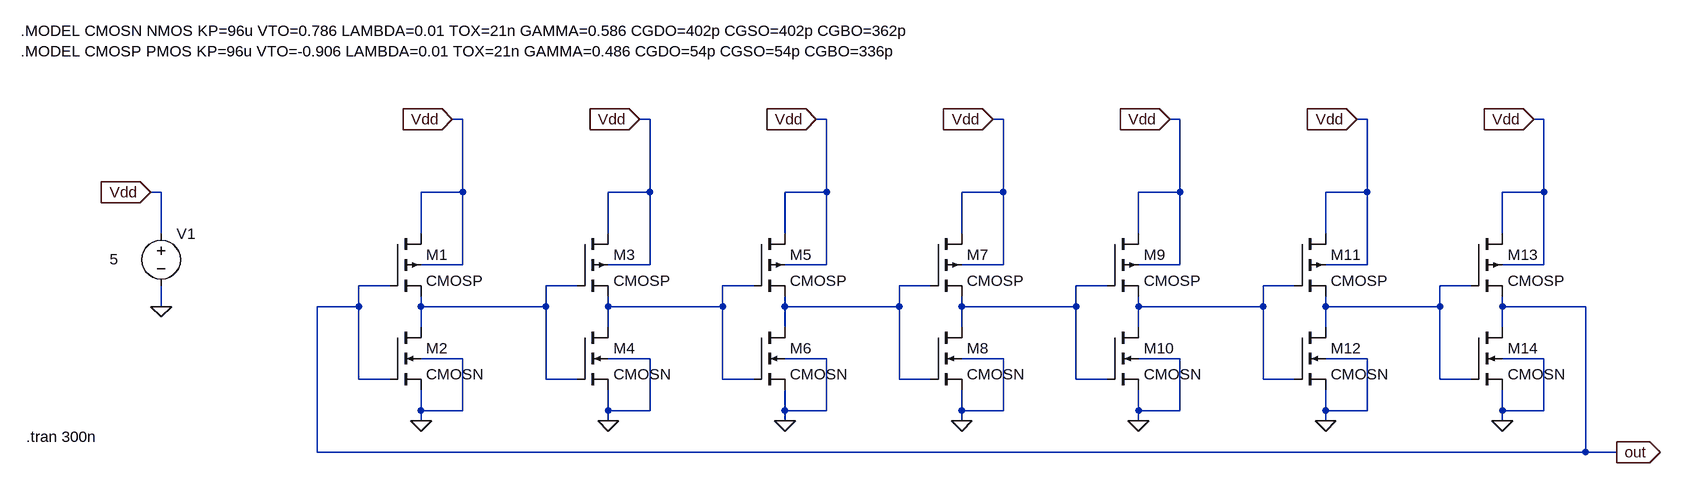
[diagram p0: schematic ring_oscillator.asc]
ring_oscillator.asc, the LTspice schematic file:
Version 4
SHEET 1 2556 680
WIRE 272 -128 256 -128
WIRE 560 -128 544 -128
WIRE 832 -128 816 -128
WIRE 1104 -128 1088 -128
WIRE 1376 -128 1360 -128
WIRE 1664 -128 1648 -128
WIRE 1936 -128 1920 -128
WIRE -192 -16 -208 -16
WIRE 272 -16 272 -128
WIRE 272 -16 208 -16
WIRE 560 -16 560 -128
WIRE 560 -16 496 -16
WIRE 832 -16 832 -128
WIRE 832 -16 768 -16
WIRE 1104 -16 1104 -128
WIRE 1104 -16 1040 -16
WIRE 1376 -16 1376 -128
WIRE 1376 -16 1312 -16
WIRE 1664 -16 1664 -128
WIRE 1664 -16 1600 -16
WIRE 1936 -16 1936 -128
WIRE 1936 -16 1872 -16
WIRE -192 48 -192 -16
WIRE 208 48 208 -16
WIRE 496 48 496 -16
WIRE 768 48 768 -16
WIRE 1040 48 1040 -16
WIRE 1312 48 1312 -16
WIRE 1600 48 1600 -16
WIRE 1872 48 1872 -16
WIRE 272 96 272 -16
WIRE 272 96 208 96
WIRE 560 96 560 -16
WIRE 560 96 496 96
WIRE 832 96 832 -16
WIRE 832 96 768 96
WIRE 1104 96 1104 -16
WIRE 1104 96 1040 96
WIRE 1376 96 1376 -16
WIRE 1376 96 1312 96
WIRE 1664 96 1664 -16
WIRE 1664 96 1600 96
WIRE 1936 96 1936 -16
WIRE 1936 96 1872 96
WIRE 160 128 112 128
WIRE 448 128 400 128
WIRE 720 128 672 128
WIRE 992 128 944 128
WIRE 1264 128 1216 128
WIRE 1552 128 1504 128
WIRE 1824 128 1776 128
WIRE -192 160 -192 128
WIRE 112 160 112 128
WIRE 112 160 48 160
WIRE 208 160 208 144
WIRE 400 160 400 128
WIRE 400 160 208 160
WIRE 496 160 496 144
WIRE 672 160 672 128
WIRE 672 160 496 160
WIRE 768 160 768 144
WIRE 944 160 944 128
WIRE 944 160 768 160
WIRE 1040 160 1040 144
WIRE 1216 160 1216 128
WIRE 1216 160 1040 160
WIRE 1312 160 1312 144
WIRE 1504 160 1504 128
WIRE 1504 160 1312 160
WIRE 1600 160 1600 144
WIRE 1776 160 1776 128
WIRE 1776 160 1600 160
WIRE 1872 160 1872 144
WIRE 2000 160 1872 160
WIRE 208 192 208 160
WIRE 496 192 496 160
WIRE 768 192 768 160
WIRE 1040 192 1040 160
WIRE 1312 192 1312 160
WIRE 1600 192 1600 160
WIRE 1872 192 1872 160
WIRE 272 240 208 240
WIRE 560 240 496 240
WIRE 832 240 768 240
WIRE 1104 240 1040 240
WIRE 1376 240 1312 240
WIRE 1664 240 1600 240
WIRE 1936 240 1872 240
WIRE 112 272 112 160
WIRE 160 272 112 272
WIRE 400 272 400 160
WIRE 448 272 400 272
WIRE 672 272 672 160
WIRE 720 272 672 272
WIRE 944 272 944 160
WIRE 992 272 944 272
WIRE 1216 272 1216 160
WIRE 1264 272 1216 272
WIRE 1504 272 1504 160
WIRE 1552 272 1504 272
WIRE 1776 272 1776 160
WIRE 1824 272 1776 272
WIRE 208 320 208 288
WIRE 272 320 272 240
WIRE 272 320 208 320
WIRE 496 320 496 288
WIRE 560 320 560 240
WIRE 560 320 496 320
WIRE 768 320 768 288
WIRE 832 320 832 240
WIRE 832 320 768 320
WIRE 1040 320 1040 288
WIRE 1104 320 1104 240
WIRE 1104 320 1040 320
WIRE 1312 320 1312 288
WIRE 1376 320 1376 240
WIRE 1376 320 1312 320
WIRE 1600 320 1600 288
WIRE 1664 320 1664 240
WIRE 1664 320 1600 320
WIRE 1872 320 1872 288
WIRE 1936 320 1936 240
WIRE 1936 320 1872 320
WIRE 208 336 208 320
WIRE 496 336 496 320
WIRE 768 336 768 320
WIRE 1040 336 1040 320
WIRE 1312 336 1312 320
WIRE 1600 336 1600 320
WIRE 1872 336 1872 320
WIRE 48 384 48 160
WIRE 2000 384 2000 160
WIRE 2000 384 48 384
WIRE 2048 384 2000 384
FLAG 208 336 0
FLAG 256 -128 Vdd
IOPIN 256 -128 In
FLAG 496 336 0
FLAG 544 -128 Vdd
IOPIN 544 -128 In
FLAG 768 336 0
FLAG 816 -128 Vdd
IOPIN 816 -128 In
FLAG 2048 384 out
IOPIN 2048 384 Out
FLAG -208 -16 Vdd
IOPIN -208 -16 In
FLAG -192 160 0
FLAG 1040 336 0
FLAG 1088 -128 Vdd
IOPIN 1088 -128 In
FLAG 1312 336 0
FLAG 1360 -128 Vdd
IOPIN 1360 -128 In
FLAG 1600 336 0
FLAG 1648 -128 Vdd
IOPIN 1648 -128 In
FLAG 1872 336 0
FLAG 1920 -128 Vdd
IOPIN 1920 -128 In
SYMBOL pmos4 160 48 R0
SYMATTR InstName M1
SYMATTR Value2 l=10u w=200u
SYMATTR Value CMOSP
SYMBOL nmos4 160 192 R0
SYMATTR InstName M2
SYMATTR Value2 l=10u w=100u
SYMATTR Value CMOSN
SYMBOL pmos4 448 48 R0
SYMATTR InstName M3
SYMATTR Value2 l=10u w=200u
SYMATTR Value CMOSP
SYMBOL nmos4 448 192 R0
SYMATTR InstName M4
SYMATTR Value2 l=10u w=100u
SYMATTR Value CMOSN
SYMBOL pmos4 720 48 R0
SYMATTR InstName M5
SYMATTR Value2 l=10u w=200u
SYMATTR Value CMOSP
SYMBOL nmos4 720 192 R0
SYMATTR InstName M6
SYMATTR Value2 l=10u w=100u
SYMATTR Value CMOSN
SYMBOL voltage -192 32 R0
WINDOW 3 -79 55 Left 2
WINDOW 123 0 0 Left 0
WINDOW 39 0 0 Left 0
SYMATTR Value 5
SYMATTR InstName V1
SYMBOL pmos4 992 48 R0
SYMATTR InstName M7
SYMATTR Value2 l=10u w=200u
SYMATTR Value CMOSP
SYMBOL nmos4 992 192 R0
SYMATTR InstName M8
SYMATTR Value2 l=10u w=100u
SYMATTR Value CMOSN
SYMBOL pmos4 1264 48 R0
SYMATTR InstName M9
SYMATTR Value2 l=10u w=200u
SYMATTR Value CMOSP
SYMBOL nmos4 1264 192 R0
SYMATTR InstName M10
SYMATTR Value2 l=10u w=100u
SYMATTR Value CMOSN
SYMBOL pmos4 1552 48 R0
SYMATTR InstName M11
SYMATTR Value2 l=10u w=200u
SYMATTR Value CMOSP
SYMBOL nmos4 1552 192 R0
SYMATTR InstName M12
SYMATTR Value2 l=10u w=100u
SYMATTR Value CMOSN
SYMBOL pmos4 1824 48 R0
SYMATTR InstName M13
SYMATTR Value2 l=10u w=200u
SYMATTR Value CMOSP
SYMBOL nmos4 1824 192 R0
SYMATTR InstName M14
SYMATTR Value2 l=10u w=100u
SYMATTR Value CMOSN
TEXT -408 -264 Left 2 !.MODEL CMOSN NMOS KP=96u VTO=0.786 LAMBDA=0.01 TOX=21n GAMMA=0.586 CGDO=402p CGSO=402p CGBO=362p\n.MODEL CMOSP PMOS KP=96u VTO=-0.906 LAMBDA=0.01 TOX=21n GAMMA=0.486 CGDO=54p CGSO=54p CGBO=336p
TEXT -400 360 Left 2 !.tran 300n

The netlist it stands for:
* ring_oscillator.asc
M1 Vdd out N001 Vdd CMOSP l=10u w=200u
M2 N001 out 0 0 CMOSN l=10u w=100u
M3 Vdd N001 N002 Vdd CMOSP l=10u w=200u
M4 N002 N001 0 0 CMOSN l=10u w=100u
M5 Vdd N002 N003 Vdd CMOSP l=10u w=200u
M6 N003 N002 0 0 CMOSN l=10u w=100u
V1 Vdd 0 5
M7 Vdd N003 N004 Vdd CMOSP l=10u w=200u
M8 N004 N003 0 0 CMOSN l=10u w=100u
M9 Vdd N004 N005 Vdd CMOSP l=10u w=200u
M10 N005 N004 0 0 CMOSN l=10u w=100u
M11 Vdd N005 N006 Vdd CMOSP l=10u w=200u
M12 N006 N005 0 0 CMOSN l=10u w=100u
M13 Vdd N006 out Vdd CMOSP l=10u w=200u
M14 out N006 0 0 CMOSN l=10u w=100u
.model NMOS NMOS
.model PMOS PMOS
.lib standard.mos
.MODEL CMOSN NMOS KP=96u VTO=0.786 LAMBDA=0.01 TOX=21n GAMMA=0.586 CGDO=402p CGSO=402p CGBO=362p
.MODEL CMOSP PMOS KP=96u VTO=-0.906 LAMBDA=0.01 TOX=21n GAMMA=0.486 CGDO=54p CGSO=54p CGBO=336p
.tran 300n
.backanno
.end